# EAGLE design heart (EAGLE 5.06)
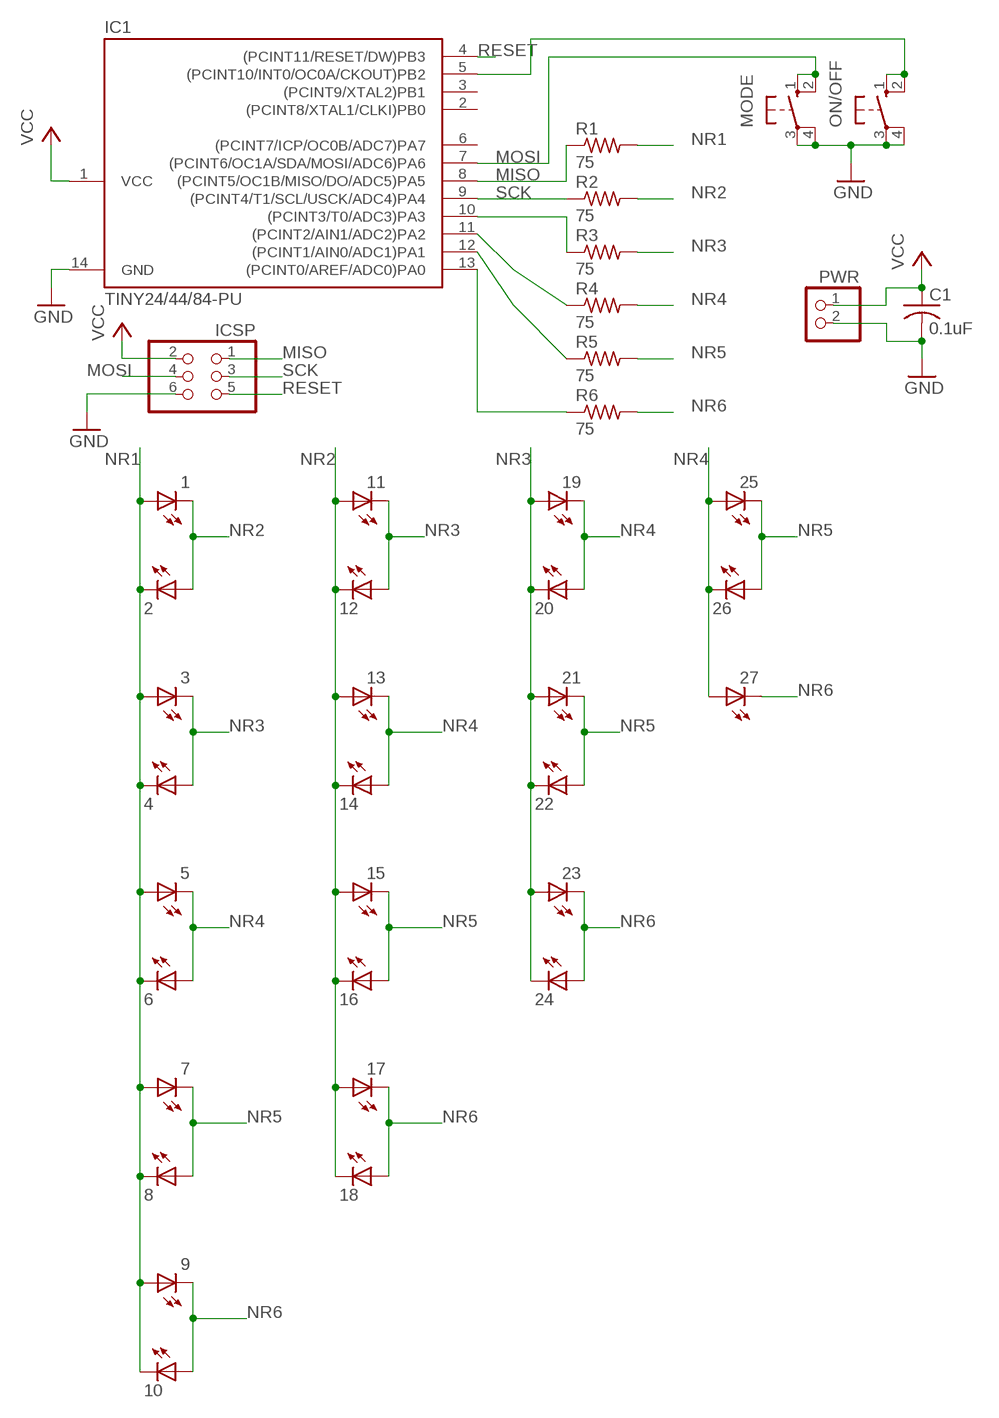
[diagram p0: schematic, sheet 1]

## Parts
1  LED5MM  [LED5MM]
2  LED5MM  [LED5MM]
3  LED5MM  [LED5MM]
4  LED5MM  [LED5MM]
5  LED5MM  [LED5MM]
6  LED5MM  [LED5MM]
7  LED5MM  [LED5MM]
8  LED5MM  [LED5MM]
9  LED5MM  [LED5MM]
10  LED5MM  [LED5MM]
11  LED5MM  [LED5MM]
12  LED5MM  [LED5MM]
13  LED5MM  [LED5MM]
14  LED5MM  [LED5MM]
15  LED5MM  [LED5MM]
16  LED5MM  [LED5MM]
17  LED5MM  [LED5MM]
18  LED5MM  [LED5MM]
19  LED5MM  [LED5MM]
20  LED5MM  [LED5MM]
21  LED5MM  [LED5MM]
22  LED5MM  [LED5MM]
23  LED5MM  [LED5MM]
24  LED5MM  [LED5MM]
25  LED5MM  [LED5MM]
26  LED5MM  [LED5MM]
27  LED5MM  [LED5MM]
C1  0.1uF  C-US025-025X050  [C025-025X050]
IC1  TINY24/44/84-PU  [DIL14]
ICSP  PINHD-2X3  [2X03]
MODE  10-XX  [B3F-10XX]
ON/OFF  10-XX  [B3F-10XX]
PWR  PINHD-1X2  [1X02]
R1  75  R-US_0207/10  [0207/10]
R2  75  R-US_0207/10  [0207/10]
R3  75  R-US_0207/10  [0207/10]
R4  75  R-US_0207/10  [0207/10]
R5  75  R-US_0207/10  [0207/10]
R6  75  R-US_0207/10  [0207/10]

## Nets
GND: C1.2 IC1.14(GND) ICSP.6 MODE.3(P) MODE.4(P1) ON/OFF.3(P) ON/OFF.4(P1) PWR.2
MISO: IC1.8((PCINT5/OC1B/MISO/DO/ADC5)PA5) ICSP.1 R1.1
MOSI: IC1.7((PCINT6/OC1A/SDA/MOSI/ADC6)PA6) ICSP.4 MODE.1(S) MODE.2(S1)
N$1: IC1.13((PCINT0/AREF/ADC0)PA0) R6.1
N$2: IC1.12((PCINT1/AIN0/ADC1)PA1) R5.1
N$3: IC1.11((PCINT2/AIN1/ADC2)PA2) R4.1
N$4: IC1.5((PCINT10/INT0/OC0A/CKOUT)PB2) ON/OFF.1(S) ON/OFF.2(S1)
N$5: IC1.10((PCINT3/T0/ADC3)PA3) R3.1
NR1: 1.A 2.K(C) 3.A 4.K(C) 5.A 6.K(C) 7.A 8.K(C) 9.A 10.K(C) R1.2
NR2: 1.K(C) 2.A 11.A 12.K(C) 13.A 14.K(C) 15.A 16.K(C) 17.A 18.K(C) R2.2
NR3: 3.K(C) 4.A 11.K(C) 12.A 19.A 20.K(C) 21.A 22.K(C) 23.A 24.K(C) R3.2
NR4: 5.K(C) 6.A 13.K(C) 14.A 19.K(C) 20.A 25.A 26.K(C) 27.A R4.2
NR5: 7.K(C) 8.A 15.K(C) 16.A 21.K(C) 22.A 25.K(C) 26.A R5.2
NR6: 9.K(C) 10.A 17.K(C) 18.A 23.K(C) 24.A 27.K(C) R6.2
RESET: IC1.4((PCINT11/RESET/DW)PB3) ICSP.5
SCK: IC1.9((PCINT4/T1/SCL/USCK/ADC4)PA4) ICSP.3 R2.1
VCC: C1.1 IC1.1(VCC) ICSP.2 PWR.1
Unconnected: IC1.2((PCINT8/XTAL1/CLKI)PB0) IC1.3((PCINT9/XTAL2)PB1) IC1.6((PCINT7/ICP/OC0B/ADC7)PA7)

## Library data of the parts
1-27 = led:LED: LED OSRAM: - CHIPLED LG R971, LG N971, LY N971, LG Q971, LY Q971, LO R971, LY R971 LH N974, LH R974 LS Q976, LO Q976, LY Q976 LO Q996 - Hyper CHIPLED LW Q18S LB Q993, LB Q99A, LB R99A - SideLED LS A670, LO A670, LY A670, LG A670, LP A670 LB A673, LV A673, LT A673, LW A673 LH A674 LY A675 LS A676, LA A676, LO A676, LY A676, LW A676 LS A679, LY A679, LG A679 - Hyper Micro SIDELED® LS Y876, LA Y876, LO Y876, LY Y876 LT Y87S - SmartLED LW L88C, LW L88S LB L89C, LB L89S, LG L890 LS L89K, LO L89K, LY L89K LS L896, LA L896, LO L896, LY L896 - TOPLED LS T670, LO T670, LY T670, LG T670, LP T670 LSG T670, LSP T670, LSY T670, LOP T670, LYG T670 LG T671, LOG T671, LSG T671 LB T673, LV T673, LT T673, LW T673 LH T674 LS T676, LA T676, LO T676, LY T676, LB T676, LH T676, LSB T676, LW T676 LB T67C, LV T67C, LT T67C, LS T67K, LO T67K, LY T67K, LW E67C LS E67B, LA E67B, LO E67B, LY E67B, LB E67C, LV E67C, LT E67C LW T67C LS T679, LY T679, LG T679 LS T770, LO T770, LY T770, LG T770, LP T770 LB T773, LV T773, LT T773, LW T773 LH T774 LS E675, LA E675, LY E675, LS T675 LS T776, LA T776, LO T776, LY T776, LB T776 LHGB T686 LT T68C, LB T68C - Hyper Mini TOPLED® LB M676 - Mini TOPLED Santana® LG M470 LS M47K, LO M47K, LY M47K Source: http://www.osram.convergy.de LUXEON: - LUMILED® LXK2-PW12-R00, LXK2-PW12-S00, LXK2-PW14-U00, LXK2-PW14-V00 LXK2-PM12-R00, LXK2-PM12-S00, LXK2-PM14-U00 LXK2-PE12-Q00, LXK2-PE12-R00, LXK2-PE12-S00, LXK2-PE14-T00, LXK2-PE14-U00 LXK2-PB12-K00, LXK2-PB12-L00, LXK2-PB12-M00, LXK2-PB14-N00, LXK2-PB14-P00, LXK2-PB14-Q00 LXK2-PR12-L00, LXK2-PR12-M00, LXK2-PR14-Q00, LXK2-PR14-R00 LXK2-PD12-Q00, LXK2-PD12-R00, LXK2-PD12-S00 LXK2-PH12-R00, LXK2-PH12-S00 LXK2-PL12-P00, LXK2-PL12-Q00, LXK2-PL12-R00 Source: www.luxeon.com KINGBRIGHT: KA-3528ASYC Source: www.kingbright.com
C1 = rcl:C-US: CAPACITOR, American symbol
IC1 = avr-4:TINY24/44/84
ICSP = pinhead:PINHD-2X3: PIN HEADER
MODE ON/OFF = switch-omron:10-XX: OMRON SWITCH
PWR = pinhead:PINHD-1X2: PIN HEADER
R1-R6 = rcl:R-US_: RESISTOR, American symbol

## Board
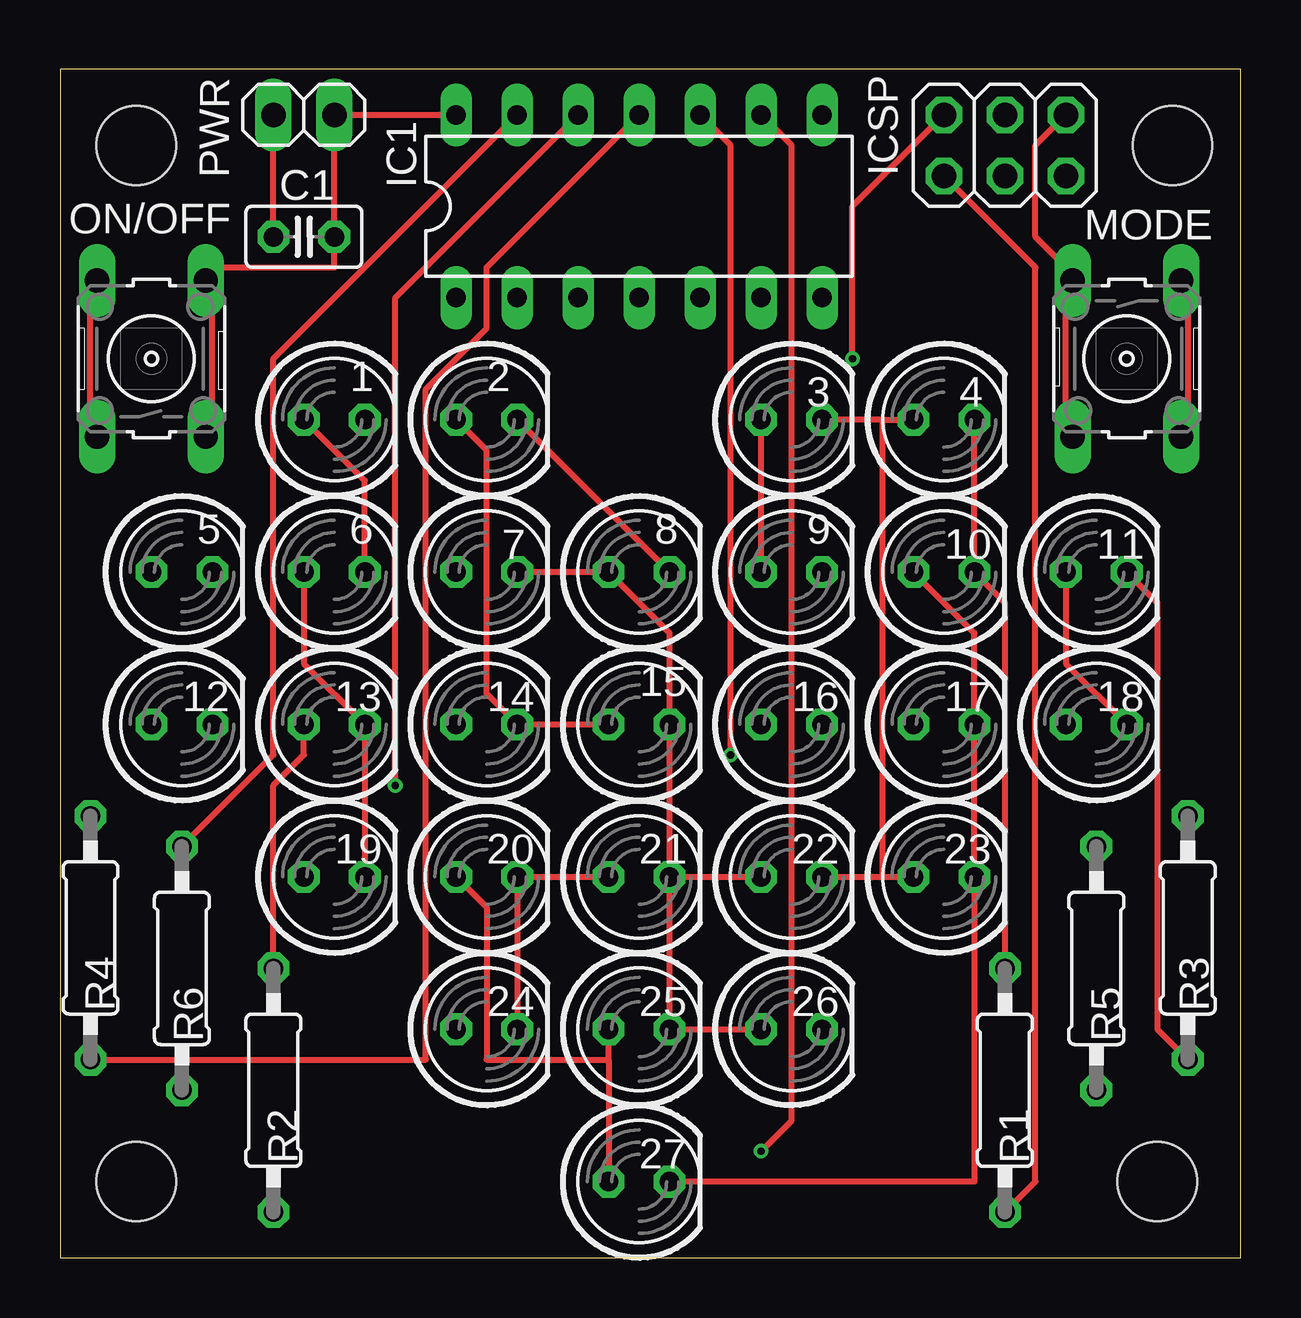
[diagram p1: board, top side]
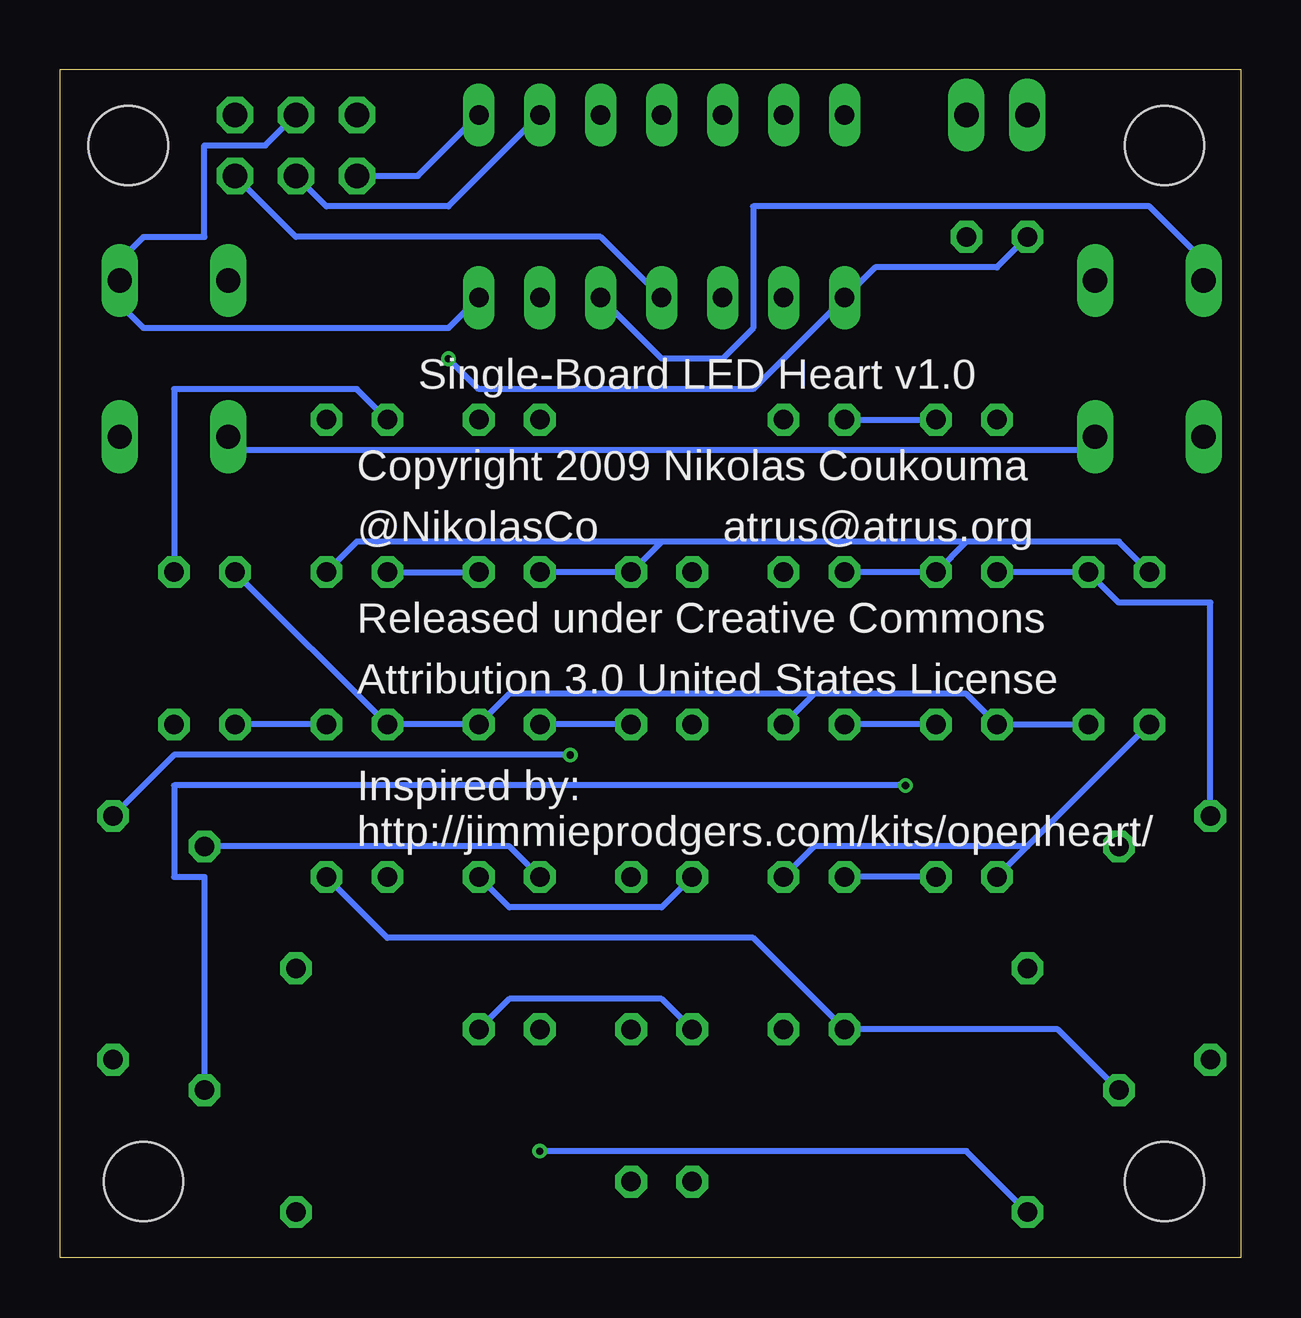
[diagram p2: board, bottom side, seen from below]

Size 49.2 x 49.52 mm. Coordinates in mm from the lower left corner, seen from the top.
Outline: 0,0 47.93,0 49.2,0 49.2,49.52 0,49.52 0,0
Copper layers (1*16): Top 0.035mm / dielectric 1.5mm / Bottom 0.035mm
Design rules "Fusion_eagle_rule_v1.1 *": minimum track width 10mil, minimum drill 12mil, track to track 10mil, track to pad 10mil, pad to pad 10mil, via to via 10mil, smd to smd 0mil, copper to edge 20mil, drill to drill 20mil, minimum pad ring 10mil, minimum via ring 6mil, stop-mask expansion 2mil, vias tented up to drill 100mil, thermal gap 10mil

### Footprints (pad centres in the part's own frame; a part is rotated, then mirrored left to right if it is on the bottom)
LED5MM = drill 0.813 octagon: A -1.27,0; K 1.27,0
C025-025X050 = drill 0.813 octagon: 1 -1.27,0; 2 1.27,0
DIL14 = drill 0.813 long: 1 -7.62,-3.81; 2 -5.08,-3.81; 3 -2.54,-3.81; 4 0,-3.81; 5 2.54,-3.81; 6 5.08,-3.81; 7 7.62,-3.81; 8 7.62,3.81; 9 5.08,3.81; 10 2.54,3.81; 11 0,3.81; 12 -2.54,3.81; 13 -5.08,3.81; 14 -7.62,3.81
2X03 = drill 1.016 octagon: 1 -2.54,-1.27; 2 -2.54,1.27; 3 0,-1.27; 4 0,1.27; 5 2.54,-1.27; 6 2.54,1.27
B3F-10XX = drill 1.016 long: 1 -3.251,2.261; 2 3.251,2.261; 3 -3.251,-2.261; 4 3.251,-2.261
1X02 = drill 1.016 long: 1 -1.27,0; 2 1.27,0
0207/10 = drill 0.813 octagon: 1 -5.08,0; 2 5.08,0
STAND-OFF = hole 3.302: 0,0

### Placement (x,y rotation side)
1  11.43,34.92 0 top
2  17.78,34.92 0 top
3  30.48,34.92 0 top
4  36.83,34.92 0 top
5  5.08,28.57 0 top
6  11.43,28.57 0 top
7  17.78,28.57 0 top
8  24.13,28.57 0 top
9  30.48,28.57 0 top
10  36.83,28.57 0 top
11  43.18,28.57 0 top
12  5.08,22.22 0 top
13  11.43,22.22 0 top
14  17.78,22.22 0 top
15  24.13,22.22 0 top
16  30.48,22.22 0 top
17  36.83,22.22 0 top
18  43.18,22.22 0 top
19  11.43,15.88 0 top
20  17.78,15.88 0 top
21  24.13,15.88 0 top
22  30.48,15.88 0 top
23  36.83,15.88 0 top
24  17.78,9.53 0 top
25  24.13,9.53 0 top
26  30.48,9.53 0 top
27  24.13,3.18 0 top
C1  10.16,42.55 0 top
IC1  24.13,43.81 0 top
ICSP  39.37,46.36 0 top
MODE  44.45,37.47 270 top
ON/OFF  3.81,37.47 90 top
PWR  10.16,47.62 0 top
R1  39.37,6.98 90 top
R2  8.89,6.98 90 top
R3  46.99,13.34 270 top
R4  1.27,13.34 90 top
R5  43.18,12.07 90 top
R6  5.08,12.07 270 top
U$1  [STAND-OFF]  45.72,3.18 0 top
U$2  [STAND-OFF]  3.17,3.18 0 top
U$3  [STAND-OFF]  3.17,46.36 0 top
U$4  [STAND-OFF]  46.35,46.36 0 top

### Tracks (layer width: path | path; a pad name or v marks a point on that pad's centre or on a via)
GND
  Top 0.254: MODE.4 41.91,34.92 41.91,40 MODE.3 41.91,41.28 40.64,42.55 40.64,46.36 ICSP.6 | ON/OFF.3 6.35,34.92 6.35,40 ON/OFF.4 6.35,41.28 11.43,41.28 C1.2 PWR.2 IC1.14
  Bottom 0.254: MODE.4 41.91,33.66 6.35,33.66 ON/OFF.3
MISO
  Top 0.254: R1.1 40.64,3.18 40.64,41.28 ICSP.1
  Bottom 0.254: IC1.8 34.29,45.08 ICSP.1
MOSI
  Top 0.254: MODE.2 46.99,34.92 46.99,40 MODE.1
  Bottom 0.254: IC1.7 33.02,38.73 45.72,38.73 46.99,40 MODE.1 46.99,41.28 45.72,42.55 43.18,42.55 43.18,46.36 40.64,46.36 ICSP.4
N$1
  Top 0.254: R6.1 8.89,20.96 8.89,37.47 IC1.13
N$2  (via drill 0.3)
  Top 0.254: v13.97,19.68 13.97,40 IC1.12
  Bottom 0.254: R5.1 43.18,15.88 44.45,15.88 44.45,19.68 v13.97,19.68
N$3
  Top 0.254: R4.1 15.24,8.25 15.24,36.2 17.78,38.73 17.78,41.28 IC1.11
N$4
  Top 0.254: ON/OFF.1 1.27,34.92 1.27,40 ON/OFF.2
  Bottom 0.254: IC1.5 24.13,37.47 21.59,37.47 20.32,38.73 20.32,43.81 3.81,43.81 1.27,41.28 ON/OFF.2
N$5  (via drill 0.3)
  Top 0.254: v27.94,20.96 27.94,46.36 IC1.10
  Bottom 0.254: R3.1 44.45,20.96 v27.94,20.96
NR1
  Top 0.254: 4.K 10.K 39.37,27.31 R1.2 | 8.K 2.K | 9.A 3.A | 1.A 12.7,32.39 6.K
  Bottom 0.254: 9.A 8.K 24.13,29.85 | 5.A 5.08,29.85 11.43,29.85 | 11.43,29.85 6.K 7.A | 11.43,29.85 24.13,29.85 | 10.K 36.83,29.85 24.13,29.85
NR2
  Top 0.254: 18.K 41.91,24.76 11.A | 15.A 14.K 17.78,23.5 17.78,33.66 2.A | R2.2 8.89,19.68 10.16,20.96 13.A
  Bottom 0.254: 11.A 17.A 16.K 30.48,23.5 17.78,23.5 | 2.A 1.K | 12.K 13.A 11.43,23.5 17.78,23.5 | 17.78,23.5 14.K
NR3
  Top 0.254: 24.K 20.K 21.A | 34.29,15.88 23.A | 22.K 34.29,15.88 | 34.29,34.92 4.A | 34.29,34.92 3.K | R3.2 45.72,9.53 45.72,27.31 11.K | 34.29,15.88 34.29,34.92
  Bottom 0.254: 12.A 8.89,17.14 | 8.89,17.14 19.A | 20.K 17.78,17.14 8.89,17.14 | 11.K 44.45,36.2 36.83,36.2 4.A | 21.A 24.13,14.61 30.48,14.61 22.K
NR4
  Top 0.254: 22.86,8.25 25.A | 22.86,8.25 27.A | 19.K 13.K 10.16,24.76 6.A | 22.86,8.25 17.78,8.25 17.78,14.61 20.A
  Bottom 0.254: 26.K 30.48,10.8 24.13,10.8 25.A | 19.K 20.A | 13.K 14.A | R4.2 1.27,27.31 5.08,27.31 5.K 6.A
NR5
  Top 0.254: 7.K 8.A 25.4,26.04 15.K 21.K | 26.A 25.K 21.K | 21.K 22.A
  Bottom 0.254: 15.K 16.A | R5.2 30.48,17.14 22.A
NR6
  Top 0.254: 27.K 38.1,3.18 23.K 17.K 38.1,26.04 10.A
  Bottom 0.254: R6.2 7.62,9.53 24.A 20.32,13.34 35.56,13.34 23.K | 10.A 9.K | 17.K 18.A
RESET
  Bottom 0.254: IC1.4 26.67,42.55 39.37,42.55 ICSP.5
SCK  (via drill 0.3)
  Top 0.254: v29.21,4.45 30.48,5.71 30.48,46.36 IC1.9
  Bottom 0.254: R2.1 11.43,4.45 v29.21,4.45 | ICSP.3 38.1,43.81 33.02,43.81 IC1.9
VCC  (via drill 0.3)
  Top 0.254: C1.1 PWR.1 | ICSP.2 33.02,43.81 v33.02,37.47
  Bottom 0.254: C1.1 10.16,41.28 15.24,41.28 IC1.1 20.32,36.2 31.75,36.2 v33.02,37.47

### Text on the board
bNames: Single-Board LED Heart v1.0 | Copyright 2009 Nikolas Coukouma | atrus@atrus.org | @NikolasCo | Released under Creative Commons | Attribution 3.0 United States License | Inspired by: | http://jimmieprodgers.com/kits/openheart/